# EAGLE design Flamingo PCB Rev 1.1 (EAGLE 8.2.2)
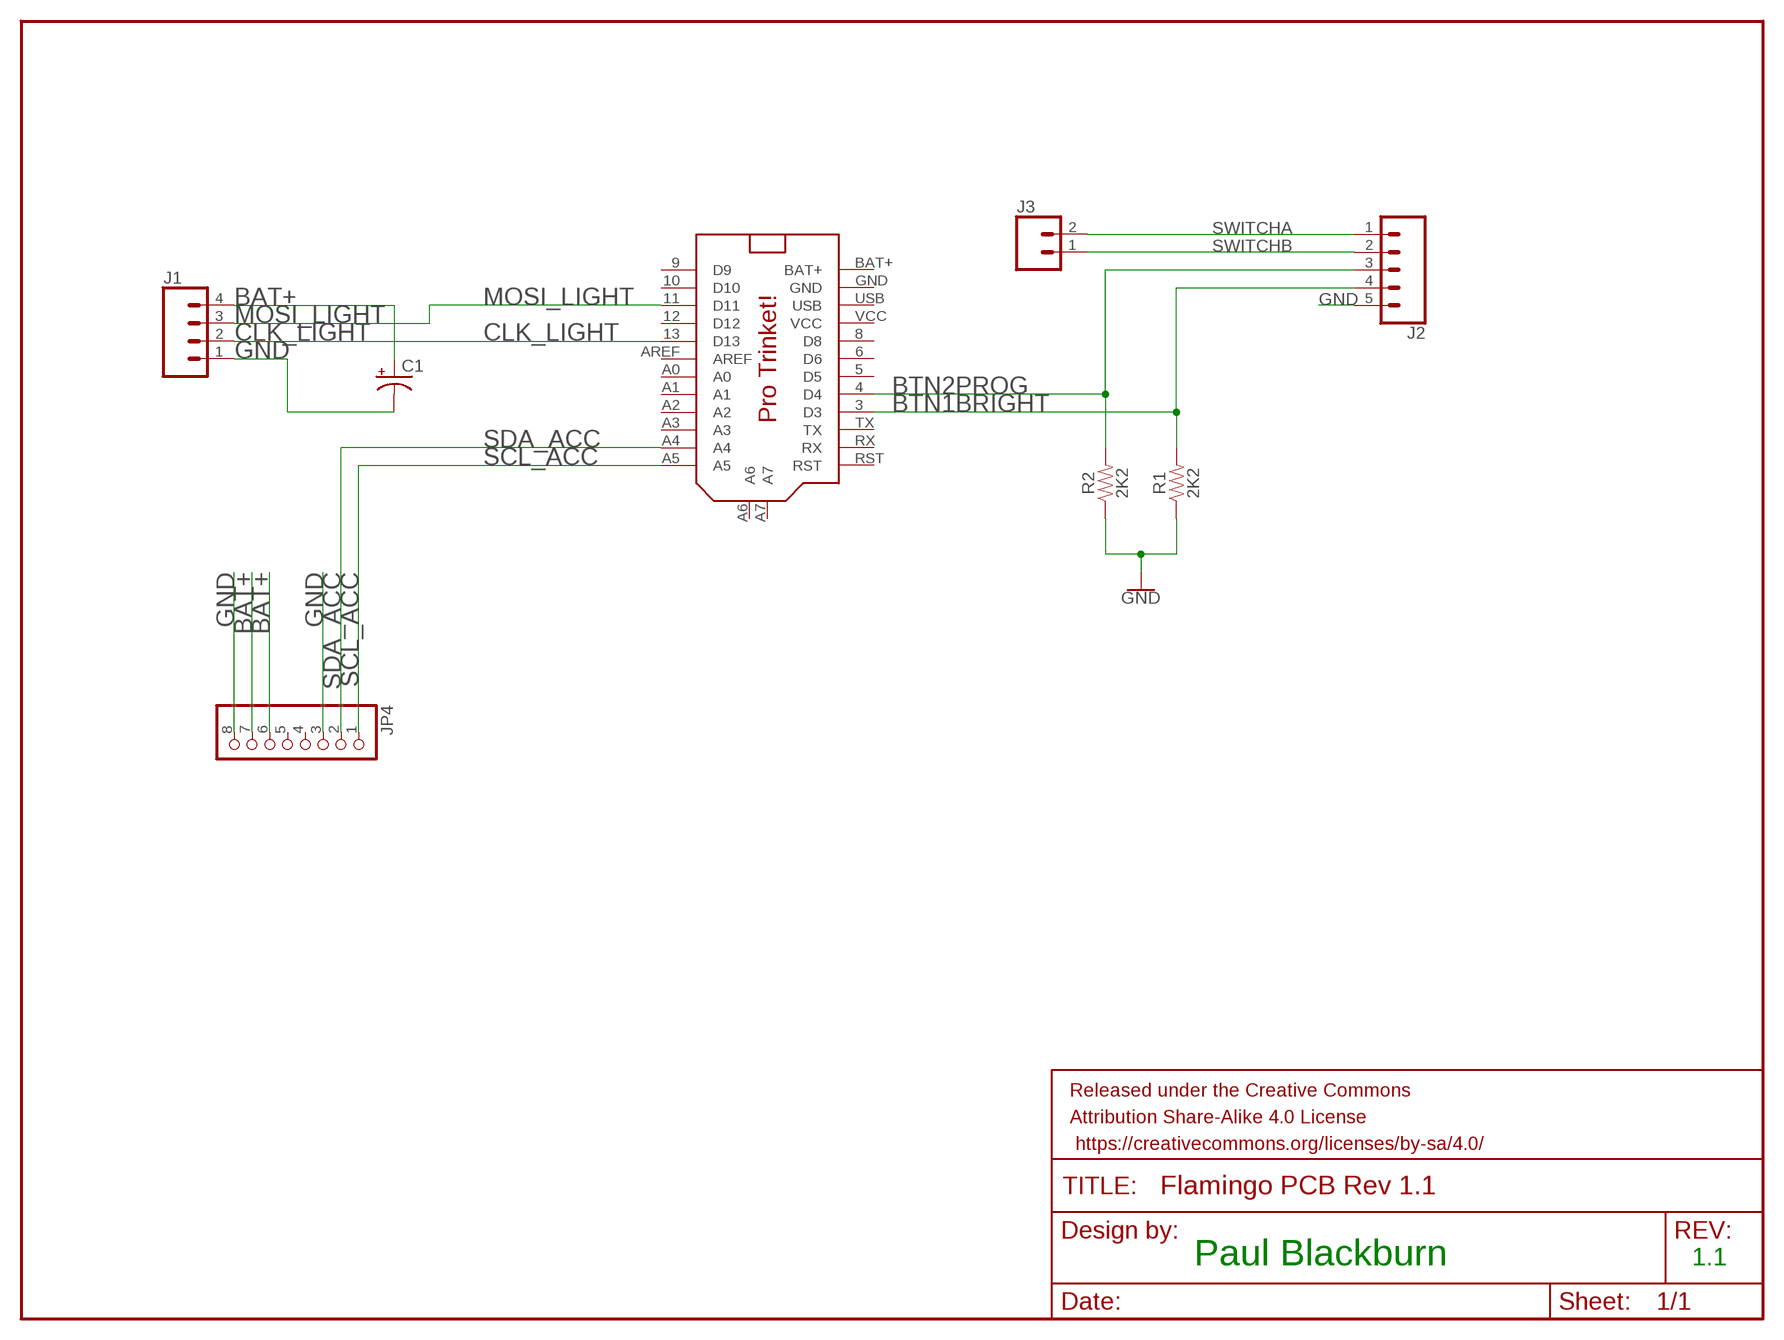
[diagram p0: schematic, sheet 1]

## Parts
C1  CPOL-USE5-6  [E5-6]
FRAME1  FRAME-LETTER  [CREATIVE_COMMONS]
J1  CONN_04  [1X04]
J2  CONN_05  [1X05]
J3  CONN_02  [1X02]
JP4  PINHD-1X8CLEANBIG  [1X08-CLEANBIG]
R1  2K2  RESISTORAXIAL-0.3  [AXIAL-0.3]
R2  2K2  RESISTORAXIAL-0.3  [AXIAL-0.3]
U$1  PRO_TRINKET  [PROTRINKET]

## Nets
BAT+: C1.+ J1.4 JP4.6 JP4.7
BTN1BRIGHT: J2.4 R1.P$2 U$1.3(D3)
BTN2PROG: J2.3 R2.P$2 U$1.4(D4)
CLK_LIGHT: J1.2 U$1.13(D13)
GND: C1.- J1.1 J2.5 JP4.3 JP4.8 R1.P$1 R2.P$1
MOSI_LIGHT: J1.3 U$1.11(D11)
SCL_ACC: JP4.1 U$1.A5
SDA_ACC: JP4.2 U$1.A4
SWITCHA: J2.1 J3.2
SWITCHB: J2.2 J3.1
Unconnected: JP4.4 JP4.5 U$1.5(D5) U$1.6(D6) U$1.8(D8) U$1.9(D9) U$1.10(D10) U$1.12(D12) U$1.A0 U$1.A1 U$1.A2 U$1.A3 U$1.A6 U$1.A7 U$1.AREF U$1.RST U$1.RX U$1.TX

## Notes on the sheet
- Paul Blackburn | 1.1

## Power pins joined to a net without a drawn wire
BAT+: U$1.BAT+
GND: U$1.GND
USB: U$1.USB
VCC: U$1.VCC

## Library data of the parts
C1 = adafruit:CPOL-US: POLARIZED CAPACITOR, American symbol
FRAME1 = SparkFun-Aesthetics:FRAME-LETTER: Schematic Frame - Letter Standard 8.5x11 US Letter frame
J1 = SparkFun-Connectors:CONN_04: Multi connection point. Often used as Generic Header-pin footprint for 0.1 inch spaced/style header connections On any of the 0.1 inch spaced packages, you can populate with these: Break Away Headers - Straight <https://www.sparkfun.com/products/116> (PRT-00116) Break Away Male Headers - Right Angle <https://www.sparkfun.com/products/553> (PRT-00553) Female Headers <https://www.sparkfun.com/products/115> (PRT-00115) Break Away Headers - Machine Pin <https://www.sparkfun.com/products/117> (PRT-00117) Break Away Female Headers - Swiss Machine Pin <https://www.sparkfun.com/products/743> (PRT-00743) For SCREWTERMINALS and SPRING TERMINALS visit here: Screw Terimnals on SparkFun.com <https://www.sparkfun.com/search/results?term=Screw+Terminals> (5mm/3.5mm/2.54mm spacing) This device is also useful as a general connection point to wire up your design to another part of your project. Our various solder wires solder well into these plated through hole pads. Hook-Up Wire - Assortment (Stranded, 22 AWG) <https://www.sparkfun.com/products/11375> (PRT-11375) Hook-Up Wire - Assortment (Solid Core, 22 AWG) <https://www.sparkfun.com/products/11367> (PRT-11367) View the entire wire category on our website here <https://www.sparkfun.com/categories/141> Special notes: Molex polarized connector foot print use with SKU : PRT-08231 with associated crimp pins and housings. 1MM SMD Version SKU: PRT-10208; PROD_ID: CONN-09696
J2 = SparkFun-Connectors:CONN_05: Multi connection point. Often used as Generic Header-pin footprint for 0.1 inch spaced/style header connections On any of the 0.1 inch spaced packages, you can populate with these: Break Away Headers - Straight <https://www.sparkfun.com/products/116> (PRT-00116) Break Away Male Headers - Right Angle <https://www.sparkfun.com/products/553> (PRT-00553) Female Headers <https://www.sparkfun.com/products/115> (PRT-00115) Break Away Headers - Machine Pin <https://www.sparkfun.com/products/117> (PRT-00117) Break Away Female Headers - Swiss Machine Pin <https://www.sparkfun.com/products/743> (PRT-00743) For SCREWTERMINALS and SPRING TERMINALS visit here: Screw Terimnals on SparkFun.com <https://www.sparkfun.com/search/results?term=Screw+Terminals> (5mm/3.5mm/2.54mm spacing) This device is also useful as a general connection point to wire up your design to another part of your project. Our various solder wires solder well into these plated through hole pads. Hook-Up Wire - Assortment (Stranded, 22 AWG) <https://www.sparkfun.com/products/11375> (PRT-11375) Hook-Up Wire - Assortment (Solid Core, 22 AWG) <https://www.sparkfun.com/products/11367> (PRT-11367) View the entire wire category on our website here <https://www.sparkfun.com/categories/141> Special notes: Molex polarized connector foot print use with SKU : PRT-08231 with associated crimp pins and housings. 1MM SMD Version SKU: PRT-10208
J3 = SparkFun-Connectors:CONN_02: Multi connection point. Often used as Generic Header-pin footprint for 0.1 inch spaced/style header connections On any of the 0.1 inch spaced packages, you can populate with these: Break Away Headers - Straight <https://www.sparkfun.com/products/116> (PRT-00116) Break Away Male Headers - Right Angle <https://www.sparkfun.com/products/553> (PRT-00553) Female Headers <https://www.sparkfun.com/products/115> (PRT-00115) Break Away Headers - Machine Pin <https://www.sparkfun.com/products/117> (PRT-00117) Break Away Female Headers - Swiss Machine Pin <https://www.sparkfun.com/products/743> (PRT-00743) For SCREWTERMINALS and SPRING TERMINALS visit here: Screw Terimnals on SparkFun.com <https://www.sparkfun.com/search/results?term=Screw+Terminals> (5mm/3.5mm/2.54mm spacing) This device is also useful as a general connection point to wire up your design to another part of your project. Our various solder wires solder well into these plated through hole pads. Hook-Up Wire - Assortment (Stranded, 22 AWG) <https://www.sparkfun.com/products/11375> (PRT-11375) Hook-Up Wire - Assortment (Solid Core, 22 AWG) <https://www.sparkfun.com/products/11367> (PRT-11367) View the entire wire category on our website here <https://www.sparkfun.com/categories/141> Special notes: Molex polarized connector foot print use with: PRT-08233 with associated crimp pins and housings. 2.54_SCREWTERM for use with PRT-10571. 3.5mm Screw Terminal footprints for PRT-08084 5mm Screw Terminal footprints for use with PRT-08432
JP4 = adafruit:PINHD-1X8: PIN HEADER
R1 R2 = SparkFun-Resistors:RESISTOR: Generic Resistor Package
U$1 = adafruit:PRO_TRINKET

## Board
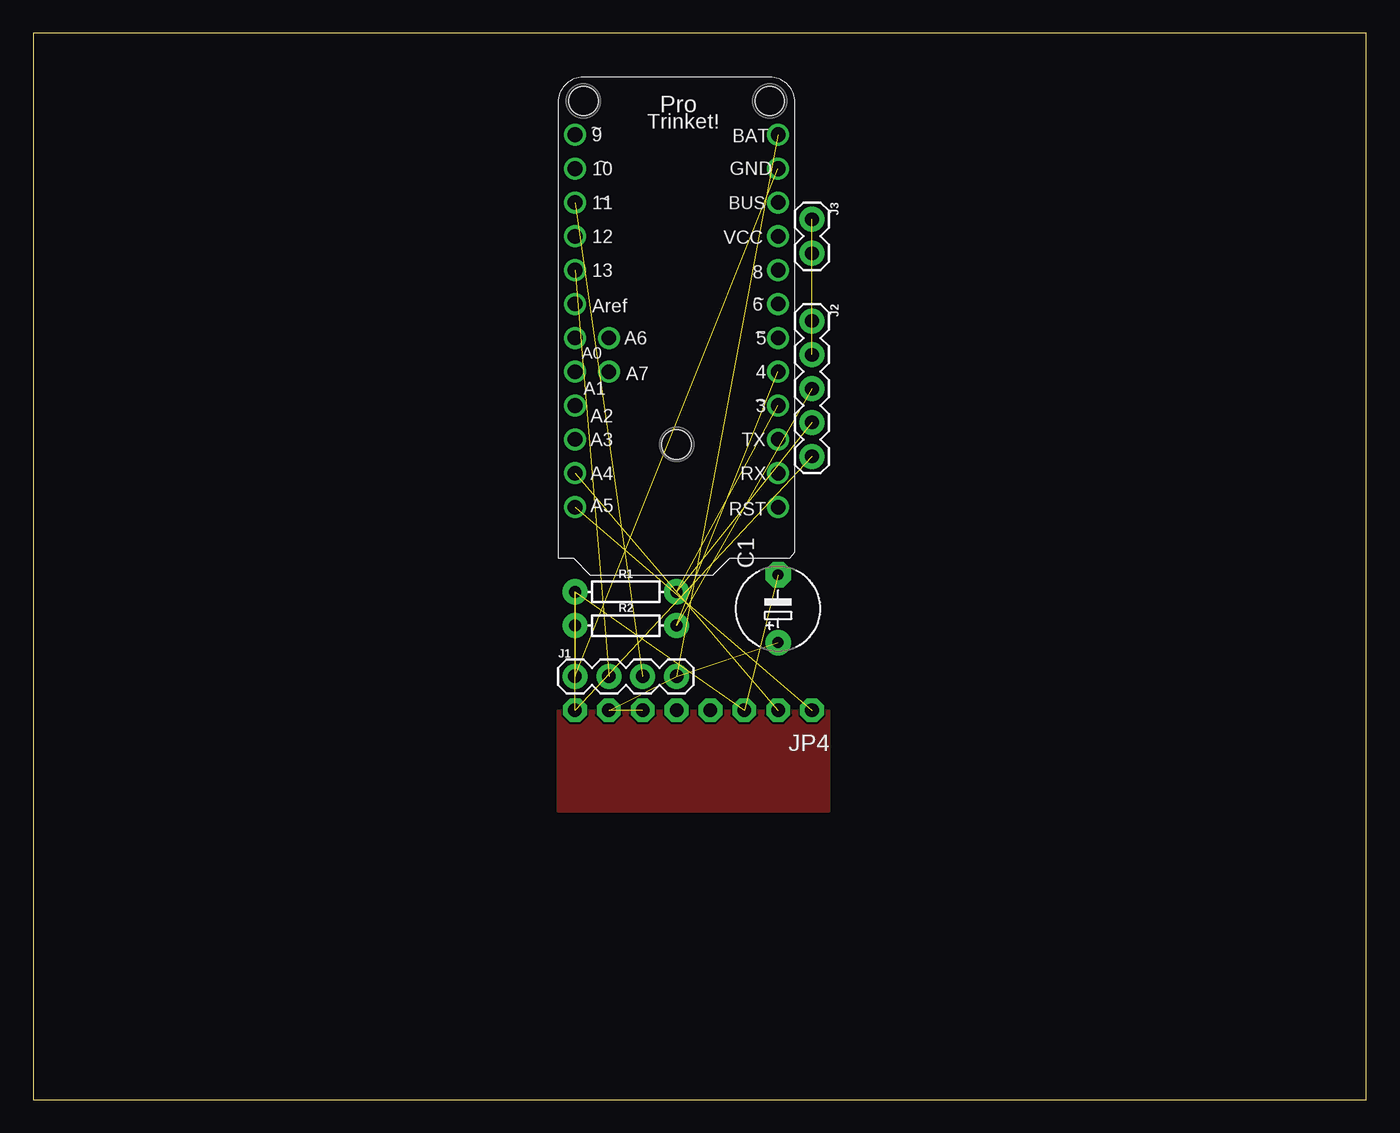
[diagram p1: board, top side]

Size 100 x 80 mm. Coordinates in mm from the lower left corner, seen from the top.
Outline: 0,0 100,0 100,80 0,80 0,0
Copper layers (1*16): Top 0.035mm / dielectric 1.5mm / Bottom 0.035mm
Design rules "default": minimum track width 6mil, minimum drill 0.35mm, track to track 6mil, track to pad 6mil, pad to pad 6mil, via to via 6mil, smd to smd 6mil, copper to edge 40mil, drill to drill 6mil, minimum pad ring 10mil, minimum via ring 8mil, stop-mask expansion 4mil, vias tented up to drill 0mil, thermal gap 10mil

### Footprints (pad centres in the part's own frame; a part is rotated, then mirrored left to right if it is on the bottom)
E5-6 = drill 0.813 pad 1.905: + -2.54,0 | drill 0.813 pad 1.905 octagon: - 2.54,0
1X04 = drill 1.016 pad 1.88: 1 0,0; 2 2.54,0; 3 5.08,0; 4 7.62,0
1X05 = drill 1.016 pad 1.88: 1 0,0; 2 2.54,0; 3 5.08,0; 4 7.62,0; 5 10.16,0
1X02 = drill 1.016 pad 1.88: 1 0,0; 2 2.54,0
1X08-CLEANBIG = drill 1.016 pad 1.778 octagon: 1 -8.89,0; 2 -6.35,0; 3 -3.81,0; 4 -1.27,0; 5 1.27,0; 6 3.81,0; 7 6.35,0; 8 8.89,0
AXIAL-0.3 = drill 0.9 pad 1.88: P$1 -3.81,0; P$2 3.81,0
PROTRINKET = drill 1.1: 3 7.62,2.921; 4 7.62,5.461; 5 7.62,8.001; 6 7.62,10.541; 8 7.62,13.081; 9 -7.62,23.241; 10 -7.62,20.701; 11 -7.62,18.161; 12 -7.62,15.621; 13 -7.62,13.081; A0 -7.62,8.001; A1 -7.62,5.461; A2 -7.62,2.921; A3 -7.62,0.381; A4 -7.62,-2.159; A5 -7.62,-4.699; A6 -5.08,8.001; A7 -5.08,5.461; AREF -7.62,10.541; BAT+ 7.62,23.241; GND 7.62,20.701; RST 7.62,-4.699; RX 7.62,-2.159; TX 7.62,0.381; USB 7.62,18.161; VCC 7.62,15.621 | hole 2.2: -6.985,25.781; 6.985,25.781; 0,0

### Placement (x,y rotation side)
C1  55.88,36.83 90 top
FRAME1  21.59,-7.62 0 top  (outside the outline)
J1  40.64,31.75 0 top
J2  58.42,58.42 270 top
J3  58.42,66.04 270 top
JP4  49.53,29.21 180 top
R1  44.45,38.1 0 top
R2  44.45,35.56 0 top
U$1  48.26,49.15 0 top

### Tracks (layer width: path | path; a pad name or v marks a point on that pad's centre or on a via)
BAT+  (4 unrouted)
BTN1BRIGHT  (2 unrouted)
BTN2PROG  (2 unrouted)
CLK_LIGHT  (1 unrouted)
GND  (7 unrouted)
MOSI_LIGHT  (1 unrouted)
N$1
  pour Top: 39.37,29.21 59.69,29.21 59.69,21.59 39.37,21.59
SCL_ACC  (1 unrouted)
SDA_ACC  (1 unrouted)
SWITCHA  (1 unrouted)
SWITCHB  (1 unrouted)

### Text on the board
Top: Paul Blackburn